# Altium schematic sheet [06] - Backlight LEDs.SchDoc: Backlight LEDs
size A3; Date: N.A.; ApprovedBy: N.A.; CheckedBy: N.A.; Author: N.A.; CompanyName: Johannes Berndorfer; DrawnBy: JBE; Organization: N.A.; Address1: Konrad Grefe Gasse 22; Address2: 1230 Wien; Address3: AUSTRIA; Address4: N.A.; DocumentNumber: 6; Revision: A; SheetNumber: 6; SheetTotal: 8; ProjectTitle: Berndo Keyboard Switchboard PCB; Reviewer: -; Time: N.A.; ImagePath: N.A.; Application_BuildNumber: N.A.
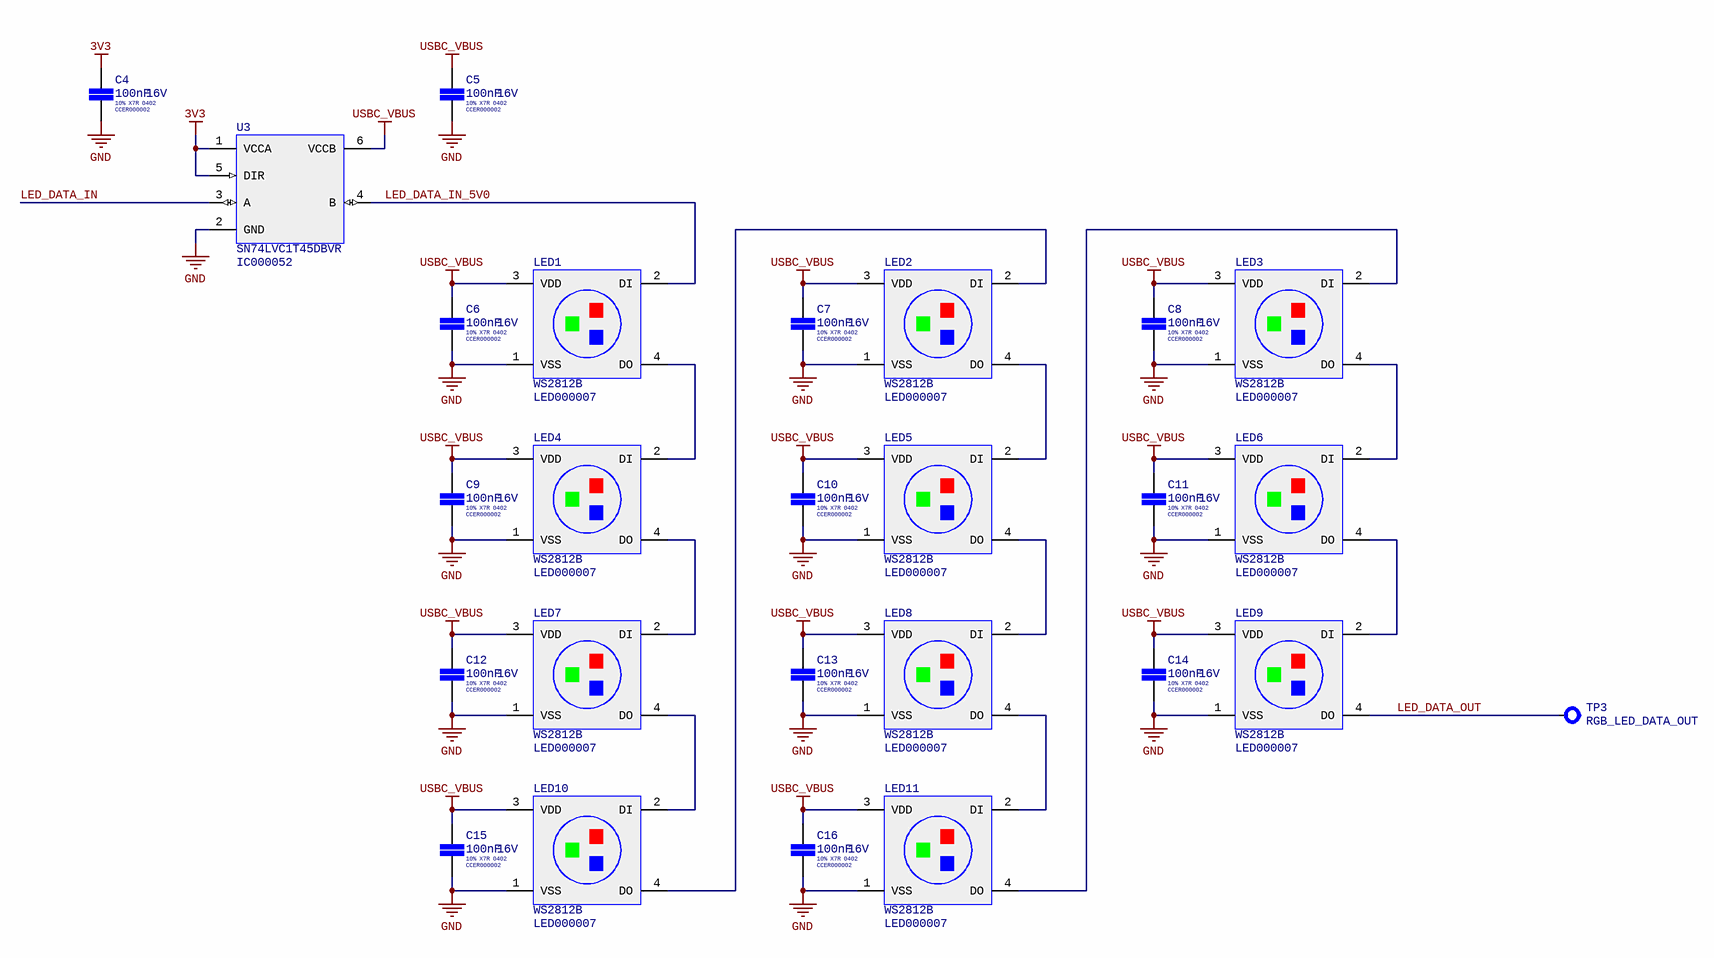
[diagram p0: [06] - Backlight LEDs.SchDoc]

## Parts
C4  Tolerance: 10%  Internal Part Number: CCER000002  Voltage Rating (DC): 16V  Dielectric: X7R  Case/Package: 0402  Capacitance: 100nF  [CAP-SMD-0402-0.55MM-IPC-MED]  (hidden comment: 100nF 16V)
C5  Tolerance: 10%  Internal Part Number: CCER000002  Voltage Rating (DC): 16V  Dielectric: X7R  Case/Package: 0402  Capacitance: 100nF  [CAP-SMD-0402-0.55MM-IPC-MED]  (hidden comment: 100nF 16V)
C6  Tolerance: 10%  Internal Part Number: CCER000002  Voltage Rating (DC): 16V  Dielectric: X7R  Case/Package: 0402  Capacitance: 100nF  [CAP-SMD-0402-0.55MM-IPC-MED]  (hidden comment: 100nF 16V)
C7  Tolerance: 10%  Internal Part Number: CCER000002  Voltage Rating (DC): 16V  Dielectric: X7R  Case/Package: 0402  Capacitance: 100nF  [CAP-SMD-0402-0.55MM-IPC-MED]  (hidden comment: 100nF 16V)
C8  Tolerance: 10%  Internal Part Number: CCER000002  Voltage Rating (DC): 16V  Dielectric: X7R  Case/Package: 0402  Capacitance: 100nF  [CAP-SMD-0402-0.55MM-IPC-MED]  (hidden comment: 100nF 16V)
C9  Tolerance: 10%  Internal Part Number: CCER000002  Voltage Rating (DC): 16V  Dielectric: X7R  Case/Package: 0402  Capacitance: 100nF  [CAP-SMD-0402-0.55MM-IPC-MED]  (hidden comment: 100nF 16V)
C10  Tolerance: 10%  Internal Part Number: CCER000002  Voltage Rating (DC): 16V  Dielectric: X7R  Case/Package: 0402  Capacitance: 100nF  [CAP-SMD-0402-0.55MM-IPC-MED]  (hidden comment: 100nF 16V)
C11  Tolerance: 10%  Internal Part Number: CCER000002  Voltage Rating (DC): 16V  Dielectric: X7R  Case/Package: 0402  Capacitance: 100nF  [CAP-SMD-0402-0.55MM-IPC-MED]  (hidden comment: 100nF 16V)
C12  Tolerance: 10%  Internal Part Number: CCER000002  Voltage Rating (DC): 16V  Dielectric: X7R  Case/Package: 0402  Capacitance: 100nF  [CAP-SMD-0402-0.55MM-IPC-MED]  (hidden comment: 100nF 16V)
C13  Tolerance: 10%  Internal Part Number: CCER000002  Voltage Rating (DC): 16V  Dielectric: X7R  Case/Package: 0402  Capacitance: 100nF  [CAP-SMD-0402-0.55MM-IPC-MED]  (hidden comment: 100nF 16V)
C14  Tolerance: 10%  Internal Part Number: CCER000002  Voltage Rating (DC): 16V  Dielectric: X7R  Case/Package: 0402  Capacitance: 100nF  [CAP-SMD-0402-0.55MM-IPC-MED]  (hidden comment: 100nF 16V)
C15  Tolerance: 10%  Internal Part Number: CCER000002  Voltage Rating (DC): 16V  Dielectric: X7R  Case/Package: 0402  Capacitance: 100nF  [CAP-SMD-0402-0.55MM-IPC-MED]  (hidden comment: 100nF 16V)
C16  Tolerance: 10%  Internal Part Number: CCER000002  Voltage Rating (DC): 16V  Dielectric: X7R  Case/Package: 0402  Capacitance: 100nF  [CAP-SMD-0402-0.55MM-IPC-MED]  (hidden comment: 100nF 16V)
LED1  WS2812B  Internal Part Number: LED000007  [LED-SMD-4-SMD-5050-WS2812B]
LED2  WS2812B  Internal Part Number: LED000007  [LED-SMD-4-SMD-5050-WS2812B]
LED3  WS2812B  Internal Part Number: LED000007  [LED-SMD-4-SMD-5050-WS2812B]
LED4  WS2812B  Internal Part Number: LED000007  [LED-SMD-4-SMD-5050-WS2812B]
LED5  WS2812B  Internal Part Number: LED000007  [LED-SMD-4-SMD-5050-WS2812B]
LED6  WS2812B  Internal Part Number: LED000007  [LED-SMD-4-SMD-5050-WS2812B]
LED7  WS2812B  Internal Part Number: LED000007  [LED-SMD-4-SMD-5050-WS2812B]
LED8  WS2812B  Internal Part Number: LED000007  [LED-SMD-4-SMD-5050-WS2812B]
LED9  WS2812B  Internal Part Number: LED000007  [LED-SMD-4-SMD-5050-WS2812B]
LED10  WS2812B  Internal Part Number: LED000007  [LED-SMD-4-SMD-5050-WS2812B]
LED11  WS2812B  Internal Part Number: LED000007  [LED-SMD-4-SMD-5050-WS2812B]
TP3  RGB_LED_DATA_OUT  [TP-SMD-CIRCULAR-1MM]
U3  SN74LVC1T45DBVR  Internal Part Number: IC000052  [SOT-23-6-H1.45MM-TI]

## Nets
3V3: C4.1 U3.1(VCCA) U3.5(DIR)
GND: C4.2 C5.2 C6.2 C7.2 C8.2 C9.2 C10.2 C11.2 C12.2 C13.2 C14.2 C15.2 C16.2 LED1.1(VSS) LED2.1(VSS) LED3.1(VSS) LED4.1(VSS) LED5.1(VSS) LED6.1(VSS) LED7.1(VSS) LED8.1(VSS) LED9.1(VSS) LED10.1(VSS) LED11.1(VSS) U3.2(GND)
USBC_VBUS: C5.1 C6.1 C7.1 C8.1 C9.1 C10.1 C11.1 C12.1 C13.1 C14.1 C15.1 C16.1 LED1.3(VDD) LED2.3(VDD) LED3.3(VDD) LED4.3(VDD) LED5.3(VDD) LED6.3(VDD) LED7.3(VDD) LED8.3(VDD) LED9.3(VDD) LED10.3(VDD) LED11.3(VDD) U3.6(VCCB)
LED_DATA_IN: U3.3(A)
LED_DATA_IN_5V0: LED1.2(DI) U3.4(B)
LED_DATA_OUT: LED9.4(DO) TP3.1
NetLED1_4: LED1.4(DO) LED4.2(DI)
NetLED2_2: LED2.2(DI) LED10.4(DO)
NetLED2_4: LED2.4(DO) LED5.2(DI)
NetLED3_2: LED3.2(DI) LED11.4(DO)
NetLED3_4: LED3.4(DO) LED6.2(DI)
NetLED4_4: LED4.4(DO) LED7.2(DI)
NetLED5_4: LED5.4(DO) LED8.2(DI)
NetLED6_4: LED6.4(DO) LED9.2(DI)
NetLED7_4: LED7.4(DO) LED10.2(DI)
NetLED8_4: LED8.4(DO) LED11.2(DI)

## Notes on the sheet
- Title:
- Project:
- Document Nr.:
- Revision:
- Date:
- Drawn By:
- Time:
- Reviewed By:
- Sheet
- of
- Size:
- A3
- Variant:
- File:

## Library data of the parts
C4-C16 = CL05B104KO5NNNC: CAP CER 100N 16V X7R 10% SMD 0402 125C SAMSUNG; Material: Ceramic; Supplier 1: Digi-Key; Manufacturer 1: Samsung; Manufacturer Part Number 1: CL05B104KO5NNNC; Stock 1: 53930414; Pricing 1: 1=0,10000, 10=0,02400, 100=0,01070, 500=0,00766, 1000=0,00602, 2500=0,00548, 5000=0,00504 (USD); RoHS: Yes; Mount: Surface Mount; Case Code (Metric): 1005; Case Code (Imperial): 0402; Contact Plating: Tin; Min Operating Temperature: -55°C; Max Operating Temperature: 125°C; Package Quantity: 1; Packaging: Tape and Reel; Voltage Rating: 16V; Voltage: 16V; Length: 1mm; Height: 0.5mm; Width: 0.02inch; Thickness: 0.022inch; Depth: 0.5mm; Radiation Hardening: No; Lead Free: Lead Free; ComponentLink1URL: https://datasheet.ciiva.com/26920/getdatasheetpartid-359683-26920169.pdf?src-supplier=Verical; ComponentLink1Description: https://datasheet.ciiva.com/26920/getdatasheetpartid-359683-26920169.pdf?src-supplier=Verical; ComponentLink2URL: https://datasheet.ciiva.com/29198/458718-da-01-en-vs-kondensator-0402-29198423.pdf?src-supplier=Conrad; ComponentLink2Description: https://datasheet.ciiva.com/29198/458718-da-01-en-vs-kondensator-0402-29198423.pdf?src-supplier=Conrad; ComponentLink3URL: https://datasheet.ciiva.com/16208/cl05b104kq5nnnc-16208343.pdf?src-supplier=Future+Electronics; ComponentLink3Description: https://datasheet.ciiva.com/16208/cl05b104kq5nnnc-16208343.pdf?src-supplier=Future+Electronics; ComponentLink4URL: https://datasheet.ciiva.com/26309/mlcc-catalogdownload2013-eng-26309003.pdf?src-supplier=Distrelec; ComponentLink4Description: https://datasheet.ciiva.com/26309/mlcc-catalogdownload2013-eng-26309003.pdf?src-supplier=Distrelec; Supplier Part Number 1: 1276-1001-6-ND
LED1-LED11 = WS2812B: LED RGB-ADDRESSABLE SERIAL 5050
TP3 = TESTPOINT_CIRCULAR_1MM
U3 = SN74LVC1T45DBVR: IC LEVEL SHIFTER BIDIR TRISTATE 1CH SOT-23-6 1V65-5V5; Manufacturer: Texas Instruments; Number of Elements: 1; Direction: Bidirectional; Propagation Delay: 3.9ns; Max Supply Voltage: 5.5V; Min Supply Voltage: 1.65V; Data Rate: 420Mbps; Logic Function: Translator,Transceiver; High Level Output Current: -32mA; Low Level Output Current: 32mA; Polarity: Non-Inverting; Turn-On Delay Time: 36.2ns; Quiescent Current: 3uA; Supplier 1: Digi-Key; Manufacturer Part Number: SN74LVC1T45DBVR; Stock 1: 70407; Pricing 1: 1 = 0,60000, 10 = 0,51000, 100 = 0,38070, 500 = 0,29912, 1000 = 0,23113 (USD); RoHS: Yes; Mount: Surface Mount; Case/Package: SOT-23; Number of Pins: 6; Weight: 0.000229oz; Contact Plating: Gold; Min Operating Temperature: -40°C; Max Operating Temperature: 85°C; Packaging: Tape and Reel; Package Quantity: 3000; Number of Channels: 1; Number of Inputs: 1; Number of Bits: 1; Length: 3.05mm; Height: 1.75mm; Width: 1.3mm; Radiation Hardening: No; REACH SVHC: No SVHC; Lead Free: Lead Free; ComponentLink1URL: https://datasheet.ciiva.com/27055/2000549-27055985.pdf?src-supplier=Jameco; ComponentLink1Description: https://datasheet.ciiva.com/27055/2000549-27055985.pdf?src-supplier=Jameco; ComponentLink2URL: https://datasheet.ciiva.com/23943/1772421-23943378.pdf?src-supplier=Newark; ComponentLink2Description: https://datasheet.ciiva.com/23943/1772421-23943378.pdf?src-supplier=Newark; ComponentLink3URL: https://datasheet.ciiva.com/15086/getdatasheetpartid-309359-15086627.pdf?src-supplier=Verical; ComponentLink3Description: https://datasheet.ciiva.com/15086/getdatasheetpartid-309359-15086627.pdf?src-supplier=Verical; ComponentLink4URL: https://datasheet.ciiva.com/7293/1862463-7293669.pdf?src-supplier=Newark; ComponentLink4Description: https://datasheet.ciiva.com/7293/1862463-7293669.pdf?src-supplier=Newark; ComponentLink5URL: https://datasheet.ciiva.com/1899/sn74lvc1t45-1899260.pdf?src-supplier=Digi-Key; ComponentLink5Description: https://datasheet.ciiva.com/1899/sn74lvc1t45-1899260.pdf?src-supplier=Digi-Key; ComponentLink6URL: https://datasheet.ciiva.com/1899/sn74lvc1t45-1899261.pdf?src-supplier=Digi-Key; ComponentLink6Description: https://datasheet.ciiva.com/1899/sn74lvc1t45-1899261.pdf?src-supplier=Digi-Key; ComponentLink7URL: https://datasheet.ciiva.com/25973/sn74lvc1t45-25973997.pdf?src-supplier=Avnet+Europe; ComponentLink7Description: https://datasheet.ciiva.com/25973/sn74lvc1t45-25973997.pdf?src-supplier=Avnet+Europe; ComponentLink8URL: https://datasheet.ciiva.com/1899/sn74lvc1t45-1899262.pdf?src-supplier=Digi-Key; ComponentLink8Description: https://datasheet.ciiva.com/1899/sn74lvc1t45-1899262.pdf?src-supplier=Digi-Key; Supplier Part Number 1: 296-16843-1-ND